# EAGLE schematic implant (EAGLE 9.6.2)
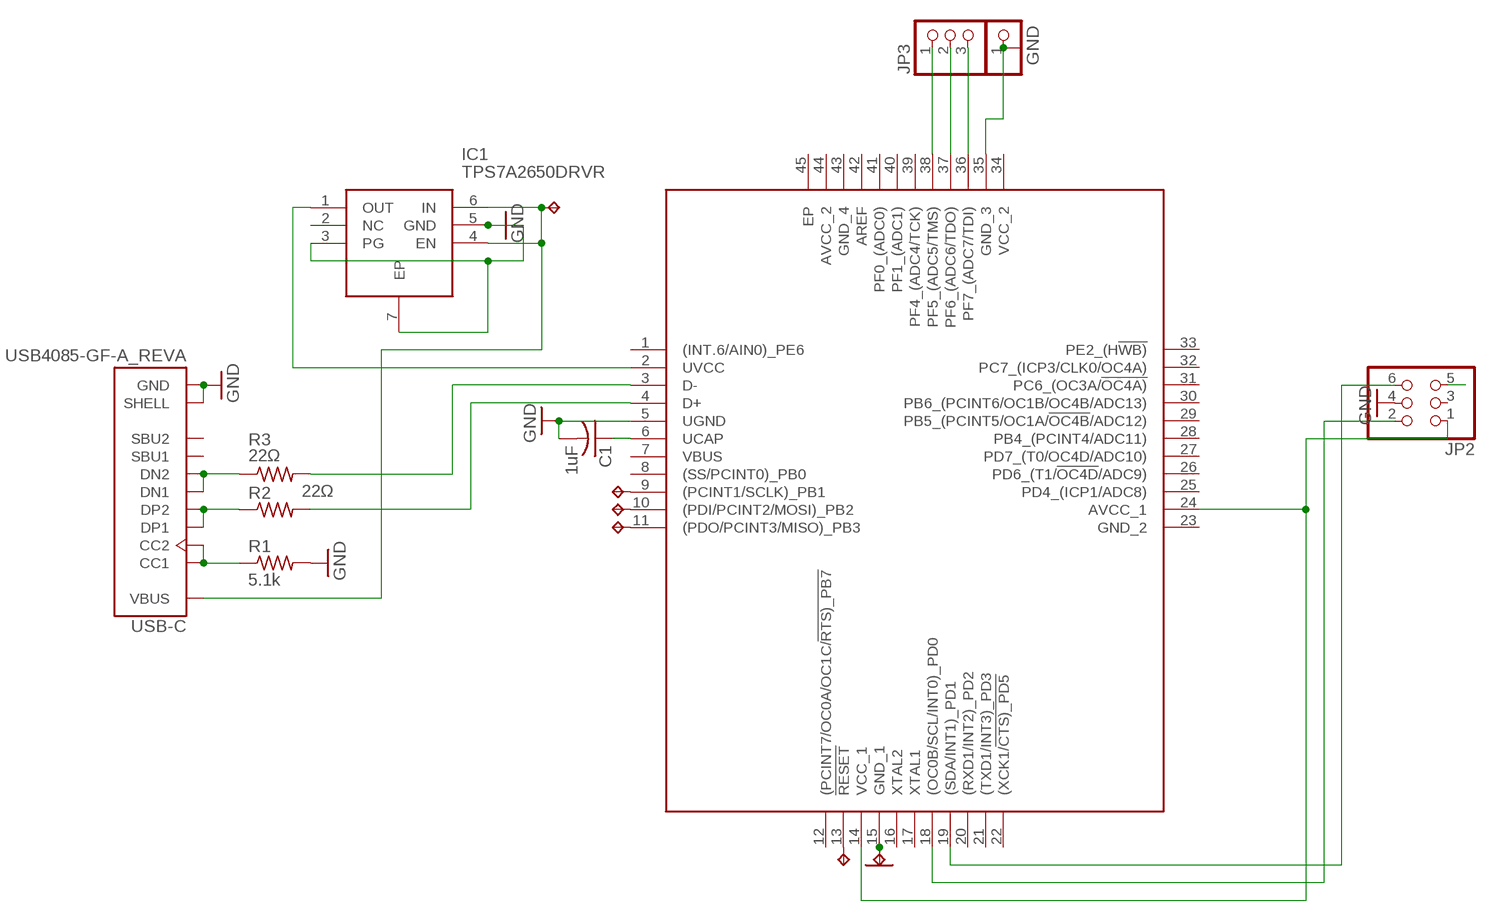
[diagram p0: schematic, sheet 1]

## Parts
5V  TPTP17R  [TP17R]
C1  1uF  C-USC0805  [C0805]
GND  TPTP17R  [TP17R]
IC1  TPS7A2650DRVR  [SON65P200X200X80-7N]
IC2  ATMEGA32U4-MU  [QFN50P700X700X100-45N]
JP1  PINHD-1X1  [1X01]
JP2  PINHD-2X3  [2X03]
JP3  PINHD-1X3  [1X03]
MISO  TPTP17R  [TP17R]
MOSI  TPTP17R  [TP17R]
R1  5.1k  R-US_R0603  [R0603]
R2  22Ω  R-US_R0805  [R0805]
R3  22Ω  R-US_R0805  [R0805]
RST  TPTP17R  [TP17R]
SCLK  TPTP17R  [TP17R]
USB-C  USB4085-GF-A_REVA  [GCT_USB4085-GF-A_REVA]

## Nets
5V: IC1.1(OUT) IC2.2(UVCC)
CAPS: IC2.38(PF5_(ADC5/TMS)) JP3.1
CC: R1.1 USB-C.A5(CC1) USB-C.B5(CC2)
CLK: IC2.19((SDA/INT1)_PD1) JP2.6
D+: R2.1 USB-C.A6(DP1) USB-C.B6(DP2)
D+RES: IC2.4(D+) R2.2
D-: R3.1 USB-C.A7(DN1) USB-C.B7(DN2)
D-RES: IC2.3(D-) R3.2
DATA: IC2.18((OC0B/SCL/INT0)_PD0) JP2.2
GND: C1.2 GND.TP IC1.3(PG) IC1.5(GND) IC1.7(EP) IC2.5(UGND) IC2.15(GND_1) IC2.35(GND_3) JP1.1 JP2.4 R1.2 USB-C.A1(GND) USB-C.A12(GND) USB-C.B1(GND) USB-C.B12(GND) USB-C.P1(SHELL) USB-C.P2(SHELL) USB-C.P3(SHELL) USB-C.P4(SHELL)
MISO: IC2.11((PDO/PCINT3/MISO)_PB3) MISO.TP
MOSI: IC2.10((PDI/PCINT2/MOSI)_PB2) MOSI.TP
NUM: IC2.37(PF6_(ADC6/TDO)) JP3.2
PE: JP2.5
RST: IC2.13(!RESET) RST.TP
SCLK: IC2.9((PCINT1/SCLK)_PB1) SCLK.TP
SCROLL: IC2.36(PF7_(ADC7/TDI)) JP3.3
UCAP: C1.1 IC2.6(UCAP)
VCC1: IC2.14(VCC_1) IC2.24(AVCC_1) JP2.1
VIN: 5V.TP IC1.4(EN) IC1.6(IN) USB-C.A4(VBUS) USB-C.A9(VBUS) USB-C.B4(VBUS) USB-C.B9(VBUS)
Unconnected: IC1.2(NC) IC2.1((INT.6/AIN0)_PE6) IC2.7(VBUS) IC2.8((SS/PCINT0)_PB0) IC2.12((PCINT7/OC0A/OC1C/!RTS)_PB7) IC2.16(XTAL2) IC2.17(XTAL1) IC2.20((RXD1/INT2)_PD2) IC2.21((TXD1/INT3)_PD3) IC2.22((XCK1/!CTS)_PD5) IC2.23(GND_2) IC2.25(PD4_(ICP1/ADC8)) IC2.26(PD6_(T1/!OC4D!/ADC9)) IC2.27(PD7_(T0/OC4D/ADC10)) IC2.28(PB4_(PCINT4/ADC11)) IC2.29(PB5_(PCINT5/OC1A/!OC4B!/ADC12)) IC2.30(PB6_(PCINT6/OC1B/OC4B/ADC13)) IC2.31(PC6_(OC3A/!OC4A)) IC2.32(PC7_(ICP3/CLK0/OC4A)) IC2.33(PE2_(H!WB)) IC2.34(VCC_2) IC2.39(PF4_(ADC4/TCK)) IC2.40(PF1_(ADC1)) IC2.41(PF0_(ADC0)) IC2.42(AREF) IC2.43(GND_4) IC2.44(AVCC_2) IC2.45(EP) JP2.3 USB-C.A8(SBU1) USB-C.B8(SBU2)

## Library data of the parts
5V GND MISO MOSI RST SCLK = testpad:TP: Test pad
C1 = adafruit:C-US: CAPACITOR, American symbol
IC1 = SamacSys_Parts:TPS7A2650DRVR: LDO Voltage Regulators 500-mA 18-V ultra-low-IQ low-dropout (LDO) linear voltage regulator with power good 6-WSON -40 to 125 Source: Datasheet <https://www.ti.com/lit/gpn/TPS7A26>; DESCRIPTION: LDO Voltage Regulators 500-mA 18-V ultra-low-IQ low-dropout (LDO) linear voltage regulator with power good 6-WSON -40 to 125; HEIGHT: 0.8mm; MANUFACTURER_NAME: Texas Instruments; MANUFACTURER_PART_NUMBER: TPS7A2650DRVR; MOUSER_PART_NUMBER: 595-TPS7A2650DRVR; MOUSER_PRICE-STOCK: https://www.mouser.co.uk/ProductDetail/Texas-Instruments/TPS7A2650DRVR?qs=OTrKUuiFdkaeaXj%2F%252BB59oA%3D%3D
IC2 = SamacSys_Parts:ATMEGA32U4-MU: MCU 8-bit ATmega AVR RISC 32KB Flash Atmel ATMEGA32U4-MU, 8bit AVR Microcontroller, 16MHz, 32 kB Flash, 44-Pin QFN Source: Datasheet <https://componentsearchengine.com/Datasheets/2/ATMEGA32U4-MU.pdf>; DESCRIPTION: MCU 8-bit ATmega AVR RISC 32KB Flash Atmel ATMEGA32U4-MU, 8bit AVR Microcontroller, 16MHz, 32 kB Flash, 44-Pin QFN; HEIGHT: 1mm; MANUFACTURER_NAME: Microchip; MANUFACTURER_PART_NUMBER: ATMEGA32U4-MU; MOUSER_PART_NUMBER: 556-ATMEGA32U4-MU; MOUSER_PRICE-STOCK: https://www.mouser.co.uk/ProductDetail/Microchip-Technology-Atmel/ATMEGA32U4-MU?qs=JV7lzlMm3yJYRpi0cY3cKw%3D%3D
JP1 = pinhead:PINHD-1X1: PIN HEADER
JP2 = pinhead:PINHD-2X3: PIN HEADER
JP3 = adafruit:PINHD-1X3: PIN HEADER
R1-R3 = adafruit:R-US_: RESISTOR, American symbol
USB-C = USB4085-GF-A_REVA:USB4085-GF-A_REVA: USB 2.0 Type C Receptacle Dip Type, PCB Top Mount Check prices <https://pricing.snapeda.com/parts/USB4085-GF-A/Global%20Connector%20Technology/view-part?ref=eda>; AVAILABILITY: Warning; DESCRIPTION: USB-C (USB TYPE-C) USB 2.0 Receptacle Connector 24 (16+8 Dummy) Position Through Hole, Right Angle; MF: Global Connector Technology; MP: USB4085-GF-A; PACKAGE: Package; PRICE: None; PURCHASE-URL: https://pricing.snapeda.com/search/part/USB4085-GF-A/?ref=eda